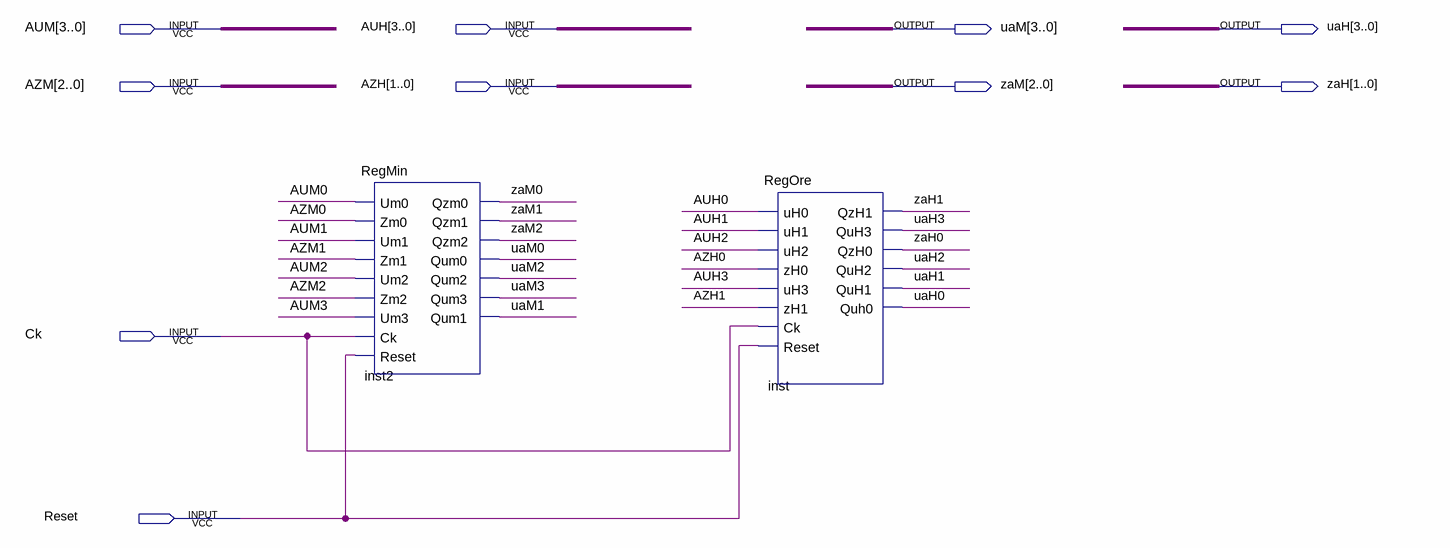
[diagram p0: schematic sheet]
// Quartus schematic MemAlarma.bdf as structural Verilog: 2 symbols, 10 pins
module MemAlarma (
  input  [3:0] AUM,
  input  [3:0] AUH,
  input  [2:0] AZM,
  input  [1:0] AZH,
  input  Ck,
  input  Reset,
  output [3:0] uaM,
  output [3:0] uaH,
  output [2:0] zaM,
  output [1:0] zaH
);

  RegMin inst2 (
    .Um0(AUM[0]), .Zm0(AZM[0]), .Um1(AUM[1]), .Zm1(AZM[1]), .Um2(AUM[2]), .Zm2(AZM[2]), .Um3(AUM[3]),
    .Ck(Ck), .Reset(Reset), .Qzm0(zaM[0]), .Qzm1(zaM[1]), .Qzm2(zaM[2]), .Qum0(uaM[0]), .Qum2(uaM[2]),
    .Qum3(uaM[3]), .Qum1(uaM[1]));
  RegOre inst (
    .uH0(AUH[0]), .uH1(AUH[1]), .uH2(AUH[2]), .zH0(AZH[0]), .uH3(AUH[3]), .zH1(AZH[1]), .Ck(Ck),
    .Reset(Reset), .QzH1(zaH[1]), .QuH3(uaH[3]), .QzH0(zaH[0]), .QuH2(uaH[2]), .QuH1(uaH[1]), .Quh0(uaH[0]));
endmodule
